# EAGLE design monitor (EAGLE 9.2.2)
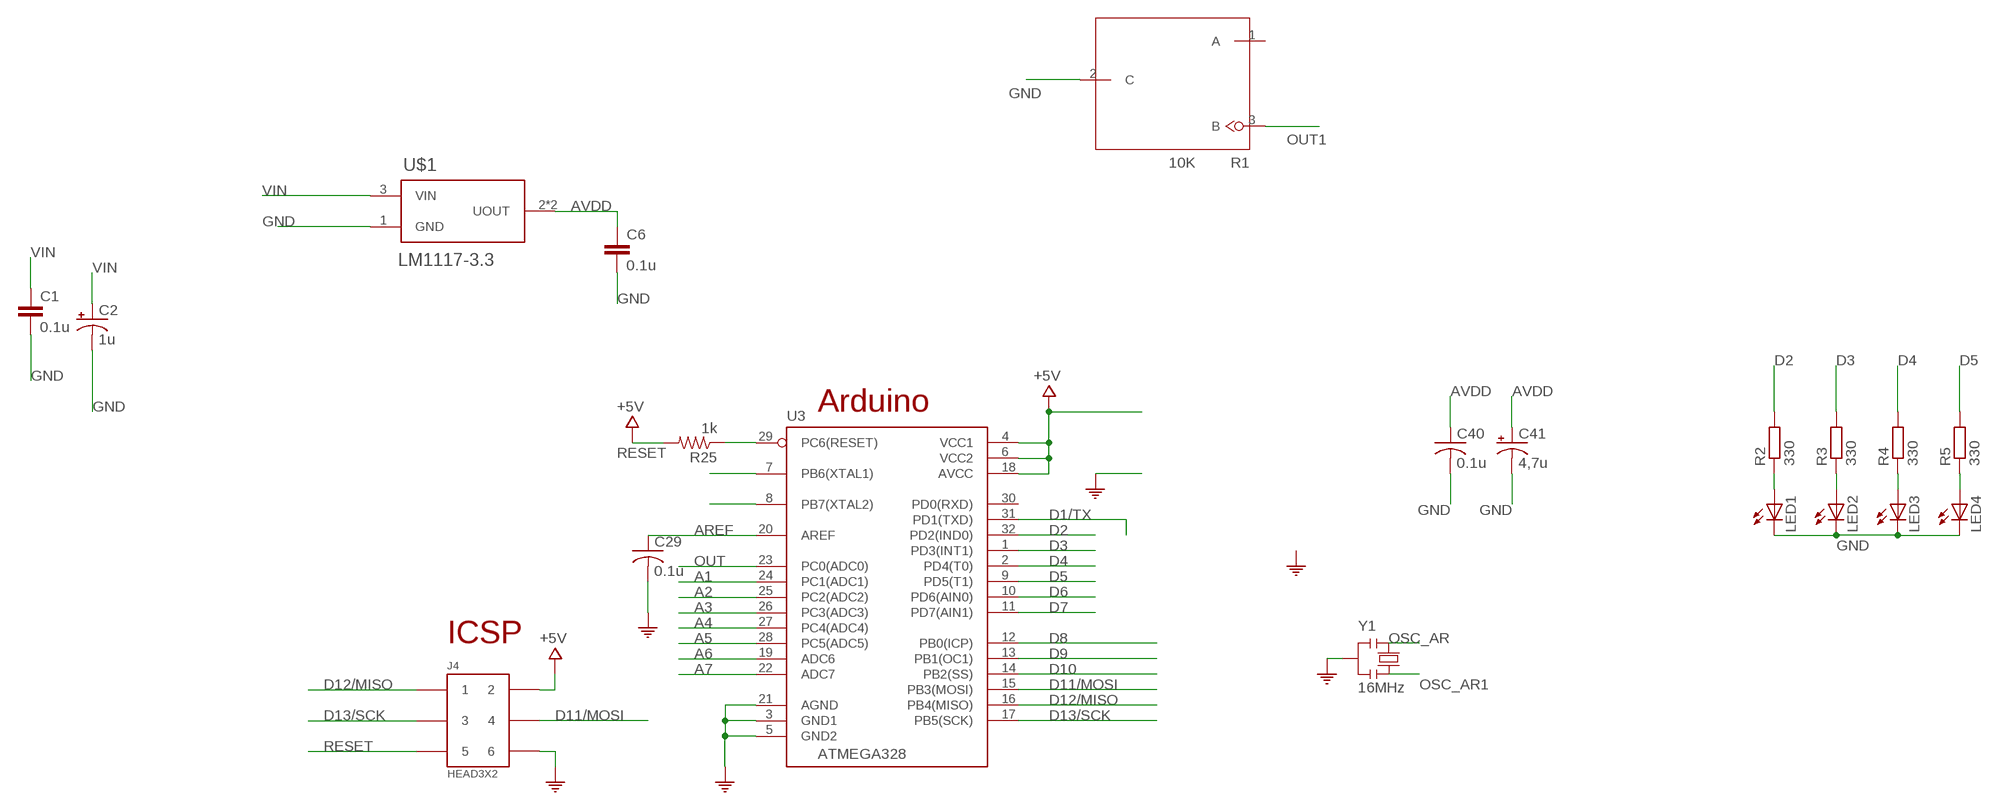
[diagram p0: schematic, sheet 1]

## Parts
C1  0.1u  C-EUC0805  [C0805]
C2  1u  CPOL-USB/3528-21W  [B/3528-21W]
C6  0.1u  C-EUC0805  [C0805]
C29  0.1u  C-USC0805K  [C0805K]
C40  0.1u  C-USC0805K  [C0805K]
C41  4,7u  CPOL-USB/3528-21W  [B/3528-21W]
J4  HEAD3X2  [HEAD3X2]
LED1  LEDCHIPLED_1206  [CHIPLED_1206]
LED2  LEDCHIPLED_1206  [CHIPLED_1206]
LED3  LEDCHIPLED_1206  [CHIPLED_1206]
LED4  LEDCHIPLED_1206  [CHIPLED_1206]
R1  10K  DEVICE_RESISTANCE  [PACKAGE__RESISTANCE]
R2  330  R-EU_R0805  [R0805]
R3  330  R-EU_R0805  [R0805]
R4  330  R-EU_R0805  [R0805]
R5  330  R-EU_R0805  [R0805]
R25  1k  R-US_M0805  [M0805]
U3  ATMEGA328  ATMEGA168-20AU  [QFP032]
U$1  LM1117-3.3  [SOT-223]
Y1  16MHz  RESONATORMU  [RESONATOR]

## Nets
A1: U3.24(PC1(ADC1))
A2: U3.25(PC2(ADC2))
A3: U3.26(PC3(ADC3))
A4: U3.27(PC4(ADC4))
A5: U3.28(PC5(ADC5))
A6: U3.19(ADC6)
A7: U3.22(ADC7)
AREF: C29.1 U3.20(AREF)
AVDD: C6.1 C40.1 C41.+ J4.2 R25.2 U3.4(VCC1) U3.6(VCC2) U3.18(AVCC) U$1.2(UOUT) U$1.4(UOUT) ; supply symbol labelled +5V
D1/TX: U3.31(PD1(TXD))
D2: R2.2 U3.32(PD2(IND0))
D3: R3.2 U3.1(PD3(INT1))
D4: R4.2 U3.2(PD4(T0))
D5: R5.2 U3.9(PD5(T1))
D6: U3.10(PD6(AIN0))
D7: U3.11(PD7(AIN1))
D8: U3.12(PB0(ICP))
D9: U3.13(PB1(OC1))
D10: U3.14(PB2(SS))
D11/MOSI: J4.4 U3.15(PB3(MOSI))
D12/MISO: J4.1 U3.16(PB4(MISO))
D13/SCK: J4.3 U3.17(PB5(SCK))
GND: C1.2 C2.- C6.2 C29.2 C40.2 C41.- J4.6 LED1.C LED2.C LED3.C LED4.C R1.2(C) U3.3(GND1) U3.5(GND2) U3.21(AGND) U$1.1(GND) Y1.2 ; supply symbol labelled COM
N$1: LED1.A R2.1
N$3: LED2.A R3.1
N$4: LED3.A R4.1
N$5: LED4.A R5.1
OSC_AR: U3.7(PB6(XTAL1)) Y1.1
OSC_AR1: U3.8(PB7(XTAL2)) Y1.3
OUT: U3.23(PC0(ADC0))
OUT1: R1.3(B)
RESET: J4.5 R25.1 U3.29(PC6(RESET))
VIN: C1.1 C2.+ U$1.3(VIN)
Unconnected: R1.1(A) U3.30(PD0(RXD))

## Notes on the sheet
- Arduino
- ICSP

## Library data of the parts
C1 C6 = rcl:C-EU: CAPACITOR, European symbol; SPICEPREFIX: C
C2 C41 = rcl:CPOL-US: POLARIZED CAPACITOR, American symbol; SPICEPREFIX: C
C29 C40 = rcl:C-US: CAPACITOR, American symbol; SPICEPREFIX: C
J4 = MyCON2:HEAD3X2
LED1-LED4 = led:LED: LED OSRAM: - CHIPLED LG R971, LG N971, LY N971, LG Q971, LY Q971, LO R971, LY R971 LH N974, LH R974 LS Q976, LO Q976, LY Q976 LO Q996 - Hyper CHIPLED LW Q18S LB Q993, LB Q99A, LB R99A - SideLED LS A670, LO A670, LY A670, LG A670, LP A670 LB A673, LV A673, LT A673, LW A673 LH A674 LY A675 LS A676, LA A676, LO A676, LY A676, LW A676 LS A679, LY A679, LG A679 - Hyper Micro SIDELED® LS Y876, LA Y876, LO Y876, LY Y876 LT Y87S - SmartLED LW L88C, LW L88S LB L89C, LB L89S, LG L890 LS L89K, LO L89K, LY L89K LS L896, LA L896, LO L896, LY L896 - TOPLED LS T670, LO T670, LY T670, LG T670, LP T670 LSG T670, LSP T670, LSY T670, LOP T670, LYG T670 LG T671, LOG T671, LSG T671 LB T673, LV T673, LT T673, LW T673 LH T674 LS T676, LA T676, LO T676, LY T676, LB T676, LH T676, LSB T676, LW T676 LB T67C, LV T67C, LT T67C, LS T67K, LO T67K, LY T67K, LW E67C LS E67B, LA E67B, LO E67B, LY E67B, LB E67C, LV E67C, LT E67C LW T67C LS T679, LY T679, LG T679 LS T770, LO T770, LY T770, LG T770, LP T770 LB T773, LV T773, LT T773, LW T773 LH T774 LS E675, LA E675, LY E675, LS T675 LS T776, LA T776, LO T776, LY T776, LB T776 LHGB T686 LT T68C, LB T68C - Hyper Mini TOPLED® LB M676 - Mini TOPLED Santana® LG M470 LS M47K, LO M47K, LY M47K Source: http://www.osram.convergy.de LUXEON: - LUMILED® LXK2-PW12-R00, LXK2-PW12-S00, LXK2-PW14-U00, LXK2-PW14-V00 LXK2-PM12-R00, LXK2-PM12-S00, LXK2-PM14-U00 LXK2-PE12-Q00, LXK2-PE12-R00, LXK2-PE12-S00, LXK2-PE14-T00, LXK2-PE14-U00 LXK2-PB12-K00, LXK2-PB12-L00, LXK2-PB12-M00, LXK2-PB14-N00, LXK2-PB14-P00, LXK2-PB14-Q00 LXK2-PR12-L00, LXK2-PR12-M00, LXK2-PR14-Q00, LXK2-PR14-R00 LXK2-PD12-Q00, LXK2-PD12-R00, LXK2-PD12-S00 LXK2-PH12-R00, LXK2-PH12-S00 LXK2-PL12-P00, LXK2-PL12-Q00, LXK2-PL12-R00 Source: www.luxeon.com KINGBRIGHT: KA-3528ASYC Source: www.kingbright.com
R1 = test:DEVICE_RESISTANCE
R2-R5 = rcl:R-EU_: RESISTOR, European symbol; SPICEPREFIX: R
R25 = rcl:R-US_: RESISTOR, American symbol; SPICEPREFIX: R
U3 = MySMD:ATMEGA168-20AU
U$1 = LM1117-3.3:LM1117-3.3; AVAILABILITY: Unavailable; MF: STMicroelectronics; MP: LM1117-3.3; PACKAGE: None; PRICE: None
Y1 = MySMD2:RESONATOR

## Board
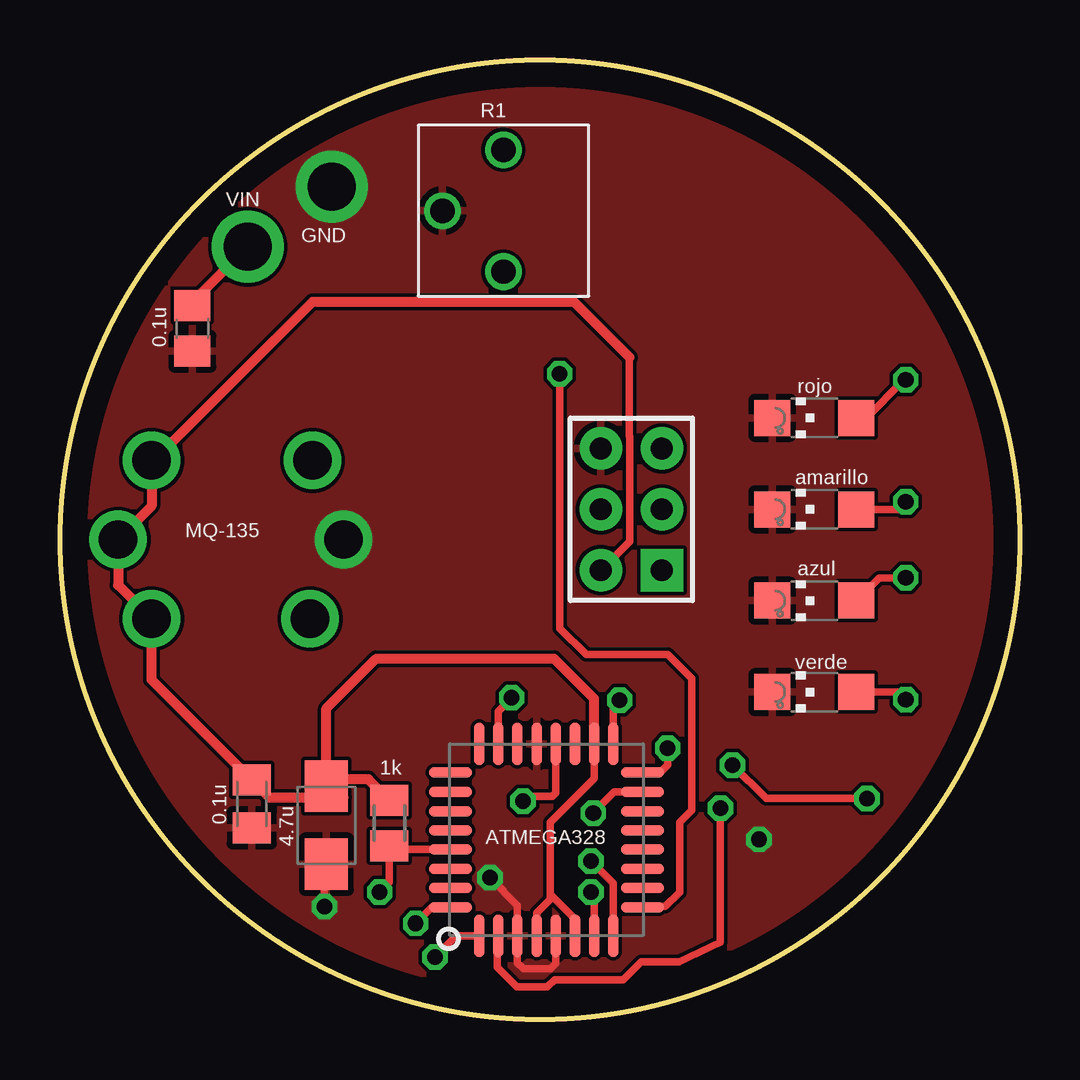
[diagram p1: board, top side]
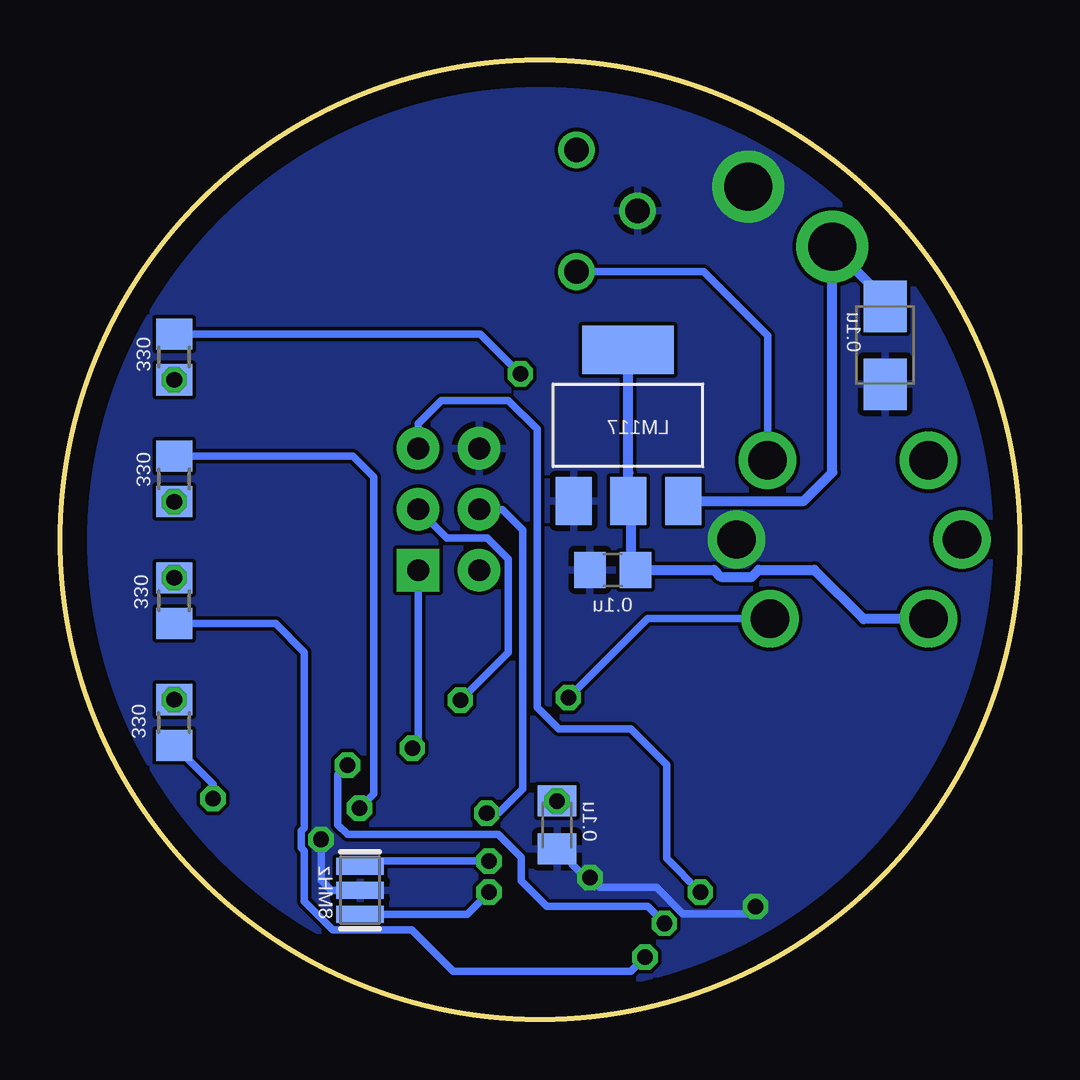
[diagram p2: board, bottom side, seen from below]

Size 40 x 40 mm. Coordinates in mm from the lower left corner, seen from the top.
Outline: circle at 20,20 radius 20
Copper layers (1*16): Top 0.035mm / dielectric 1.5mm / Bottom 0.035mm
Design rules "default": minimum track width 6mil, minimum drill 0.35mm, track to track 6mil, track to pad 6mil, pad to pad 6mil, via to via 6mil, smd to smd 6mil, copper to edge 40mil, drill to drill 6mil, minimum pad ring 10mil, minimum via ring 8mil, stop-mask expansion 4mil, vias tented up to drill 0mil, thermal gap 10mil

### Footprints (pad centres in the part's own frame; a part is rotated, then mirrored left to right if it is on the bottom)
C0805 = smd 1.3 x 1.5: 1 -0.95,0; 2 0.95,0
B/3528-21W = smd 2.15 x 1.8: + 1.625,0; - -1.625,0
C0805K = smd 1.3 x 1.6: 1 -1,0; 2 1,0
HEAD3X2 = drill 0.914 pad 1.778 square: 1 0,0 | drill 0.914 pad 1.778: 2 0,2.54; 3 2.54,0; 4 2.54,2.54; 5 5.08,0; 6 5.08,2.54
CHIPLED_1206 = smd 1.5 x 1.5: A 0,-1.75; C 0,1.75
PACKAGE__RESISTANCE = drill 1.016: 1 -2.286,-0.254; 2 0.254,-2.794; 3 2.794,-0.254
R0805 = smd 1.3 x 1.5: 1 -0.95,0; 2 0.95,0
M0805 = smd 1.3 x 1.6: 1 -0.95,0; 2 0.95,0
QFP032 = smd 0.432 x 1.778: 1 0,0; 2 0.8,0; 3 1.599,0; 4 2.399,0; 5 3.199,0; 6 3.998,0; 7 4.798,0; 8 5.598,0; 17 5.588,8.001; 18 4.798,7.997; 19 3.998,7.997; 20 3.199,7.997; 21 2.399,7.997; 22 1.599,7.997; 23 0.799,7.997; 24 0,7.997 | smd 1.778 x 0.432: 9 6.807,1.194; 10 6.807,2.007; 11 6.807,2.794; 12 6.807,3.607; 13 6.807,4.394; 14 6.807,5.182; 15 6.807,5.994; 16 6.816,6.803; 25 -1.194,6.807; 26 -1.194,5.994; 27 -1.194,5.182; 28 -1.194,4.394; 29 -1.194,3.607; 30 -1.194,2.794; 31 -1.194,2.007; 32 -1.194,1.194
SOT-223 = smd 1.499 x 2.007: 1 -2.261,-3.15; 2 0.025,-3.15; 3 2.311,-3.15 | smd 3.81 x 2.007: 4 0,3.15
RESONATOR = smd 0.7 x 2: 1 -1,0; 2 0,0; 3 1,0

### Placement (x,y rotation side)
C1  5.52,28.81 270 top
C2  5.62,28.11 90 bottom
C6  16.97,18.74 180 bottom
C29  19.29,8.11 270 bottom
C40  7.99,8.99 270 top
C41  11.1,8.1 90 top
J4  25.08,18.73 90 top
LED1  31.43,13.65 90 top
LED2  31.43,17.46 90 top
LED3  31.43,21.27 90 top
LED4  31.43,25.08 90 top
R1  18.73,33.97 270 top
R2  35.24,12.38 270 bottom
R3  35.24,17.46 270 bottom
R4  35.24,22.54 90 bottom
R5  35.24,27.62 90 bottom
R25  13.72,8.19 90 top
U3  17.46,3.49 0 top
U$1  16.34,24.77 0 bottom
Y1  27.5,5.39 90 bottom

### Tracks (layer width: path | path; a pad name or v marks a point on that pad's centre or on a via)
AREF  (via drill 0.65)
  Top 0.305: U3.20 20.66,9.45 20.52,9.31 19.49,9.31 C29.1
  other vias: 19.29,9.11
AVDD  (via drill 1.6)
  Top 0.305: C41.+ 11.57,9.26 11.87,9.26 11.11,10.02 | U3.4 19.86,4.45 20.42,5.01 20.42,5.21 | 20.42,5.21 20.42,8.21 22.26,10.05 U3.18 | 23.72,27.61 23.72,24.32 23.73,24.3 23.73,19.92 J4.2 | U3.6 21.46,4.17 20.42,5.21 | v3.82,23.31 3.82,23.21
  Top 0.406: U3.18 22.26,13.37 20.58,15.05 13.18,15.05 11.1,12.96 C41.+ 10.8,9.73 | 11.57,9.26 8.72,9.26 C40.1 3.82,14.16 v3.82,16.71 2.42,18.11 v2.42,20.01 3.82,21.41 3.82,23.21 10.52,29.91 21.42,29.91 23.72,27.61 | R25.2 12.84,10.02 11.11,10.02
  Bottom 0.305: v3.82,16.71 3.84,16.69
  Bottom 0.406: 3.84,16.69 6.52,16.69 8.57,18.74 10.89,18.74 11.18,18.45 12.46,18.45 12.75,18.74 C6.1 16.22,18.94 16.22,21.01 16.34,21.13 16.34,22.81 | U$1.4 16.34,22.81 | U$1.2 16.31,22.79 16.34,22.81
D2  (via drill 0.65)
  Top 0.305: v33.62,9.21 29.42,9.21 v28.02,10.61 | v14.82,4.01 15.49,4.68 U3.32
  Bottom 0.305: R2.2 33.62,9.81 v33.62,9.21 | v28.02,10.61 28.42,10.21 28.42,8.11 28.02,7.71 21.74,7.71 20.79,6.76 20.79,5.78 19.72,4.71 15.52,4.71 v14.82,4.01
D3  (via drill 0.65)
  Top 0.305: v15.62,2.61 16.5,3.49 U3.1
  Bottom 0.305: R3.2 31.02,16.51 29.82,15.31 29.82,8.51 29.82,8.31 29.82,7.99 29.95,7.86 29.95,7.16 29.82,7.03 29.82,4.93 28.63,3.73 25.34,3.73 23.62,2.01 16.22,2.01 v15.62,2.61
D4  (via drill 0.65)
  Top 0.305: v27.52,8.81 27.52,5.51 27.52,3.21 25.8,2.41 24.22,2.41 23.46,1.65 22.63,1.65 22.62,1.65 20.61,1.65 20.31,1.36 19.03,1.36 18.22,2.17 18.22,3.45 U3.2
  Bottom 0.305: R4.2 27.8,23.49 26.92,22.61 26.92,9.41 v27.52,8.81
D5  (via drill 0.65)
  Top 0.305: v20.82,26.91 20.82,16.31 21.92,15.21 25.32,15.21 26.32,14.21 26.32,8.71 25.82,8.21 25.82,5.31 25.22,4.71 24.29,4.71 U3.9
  Bottom 0.305: R5.2 22.48,28.57 v20.82,26.91
D11/MOSI  (via drill 0.65)
  Top 0.305: v22.22,8.61 23.09,9.48 U3.15
  Bottom 0.305: J4.4 21.58,21.27 20.72,20.41 20.72,9.61 21.72,8.61 v22.22,8.61
D12/MISO  (via drill 0.65)
  Top 0.305: U3.16 25,10.29 25.32,10.61 v25.32,11.31
  Bottom 0.305: v25.32,11.31 25.08,11.55 J4.1
D13/SCK  (via drill 0.65)
  Top 0.305: U3.17 23.05,13.04 v23.32,13.31
  Bottom 0.305: J4.3 23.89,20.08 22.2,20.08 21.32,19.2 21.32,15.31 v23.32,13.31
GND  (via drill 0.65, 1.6, 2)
  Top 0.305: U3.5 20.66,2.35 20.42,2.11 19.32,2.11 19.06,2.37 U3.3 19.06,4.77 v17.92,5.91 | v11.02,4.71 11.02,6.39 C41.-
  Bottom 0.305: C29.2 18.09,5.91 v17.92,5.91 17.52,5.51 15.14,5.51 14.04,4.41 11.32,4.41 v11.02,4.71 | Y1.2 28.7,5.39 29.12,5.81 v29.12,7.51
  other vias: 11.32,34.71 11.82,20.01
  pour Top: 20.22,0.01 arc-90 0.02,20.21 0.02,21.01 arc-90 18.92,39.91 21.22,39.91 arc-90 40.02,21.11 40.02,19.71 arc-90 20.32,0.01
  pour Bottom: 0.02,19.91 arc-90 20.12,40.01 20.82,40.01 arc-90 39.92,20.91 39.92,17.61 arc-90 22.32,0.01 19.42,0.01 arc-90 0.02,19.41
N$1  (via drill 0.65)
  Top 0.305: LED1.A 34.88,13.65 35.22,13.31 R2.1
  other vias: 35.24,13.33
N$3  (via drill 0.65)
  Top 0.305: LED2.A 34.13,18.41 R3.1
  other vias: 35.24,18.41
N$4  (via drill 0.65)
  Top 0.305: LED3.A 35.08,21.27 35.32,21.51 R4.1
  other vias: 35.24,21.59
N$5  (via drill 0.65)
  Top 0.305: LED4.A 33.59,25.08 35.12,26.61 35.18,26.61 R5.1
  other vias: 35.24,26.67
OSC_AR  (via drill 0.65)
  Top 0.305: U3.7 22.26,5.17 v22.12,5.31
  Bottom 0.305: v22.12,5.31 23.04,4.39 Y1.1
OSC_AR1  (via drill 0.65)
  Top 0.305: U3.8 23.06,5.67 v22.12,6.61
  Bottom 0.305: v22.12,6.61 27.28,6.61 Y1.3
OUT  (via drill 0.65, 1.6)
  Top 0.305: v18.82,13.41 18.26,12.85 U3.23
  Bottom 0.305: v18.82,13.41 15.52,16.71 v10.42,16.71
OUT1  (via drill 1.6)
  Bottom 0.305: 18.39,31.18 R1.3 13.19,31.18 10.52,28.51 v10.52,23.31
RESET  (via drill 0.65)
  Top 0.305: U3.29 13.86,7.1 R25.1 13.72,5.71 v13.32,5.31
  Bottom 0.305: v13.32,5.31 14.72,6.71 14.72,10.61 16.22,12.11 19.22,12.11 20.12,13.01 20.12,24.61 21.32,25.81 24.12,25.81 25.08,24.85 J4.5
VIN  (via drill 2)
  Top 0.406: C1.1 5.52,29.91 v7.82,32.21
  Bottom 0.406: U$1.3 9.01,21.62 7.82,22.81 v7.82,32.21 5.62,30.01 C2.+

### Text on the board
tPlace: R1 | VIN | GND | 0.1u | rojo | amarillo | MQ-135 | azul | verde | 0.1u | 1k | 4.7u | ATMEGA328
bPlace: 0.1u | 330 | LM117 | 330 | 0.1u | 330 | 330 | 0.1u | 8MHz